# Altium project IMX547_Module.PrjPcb
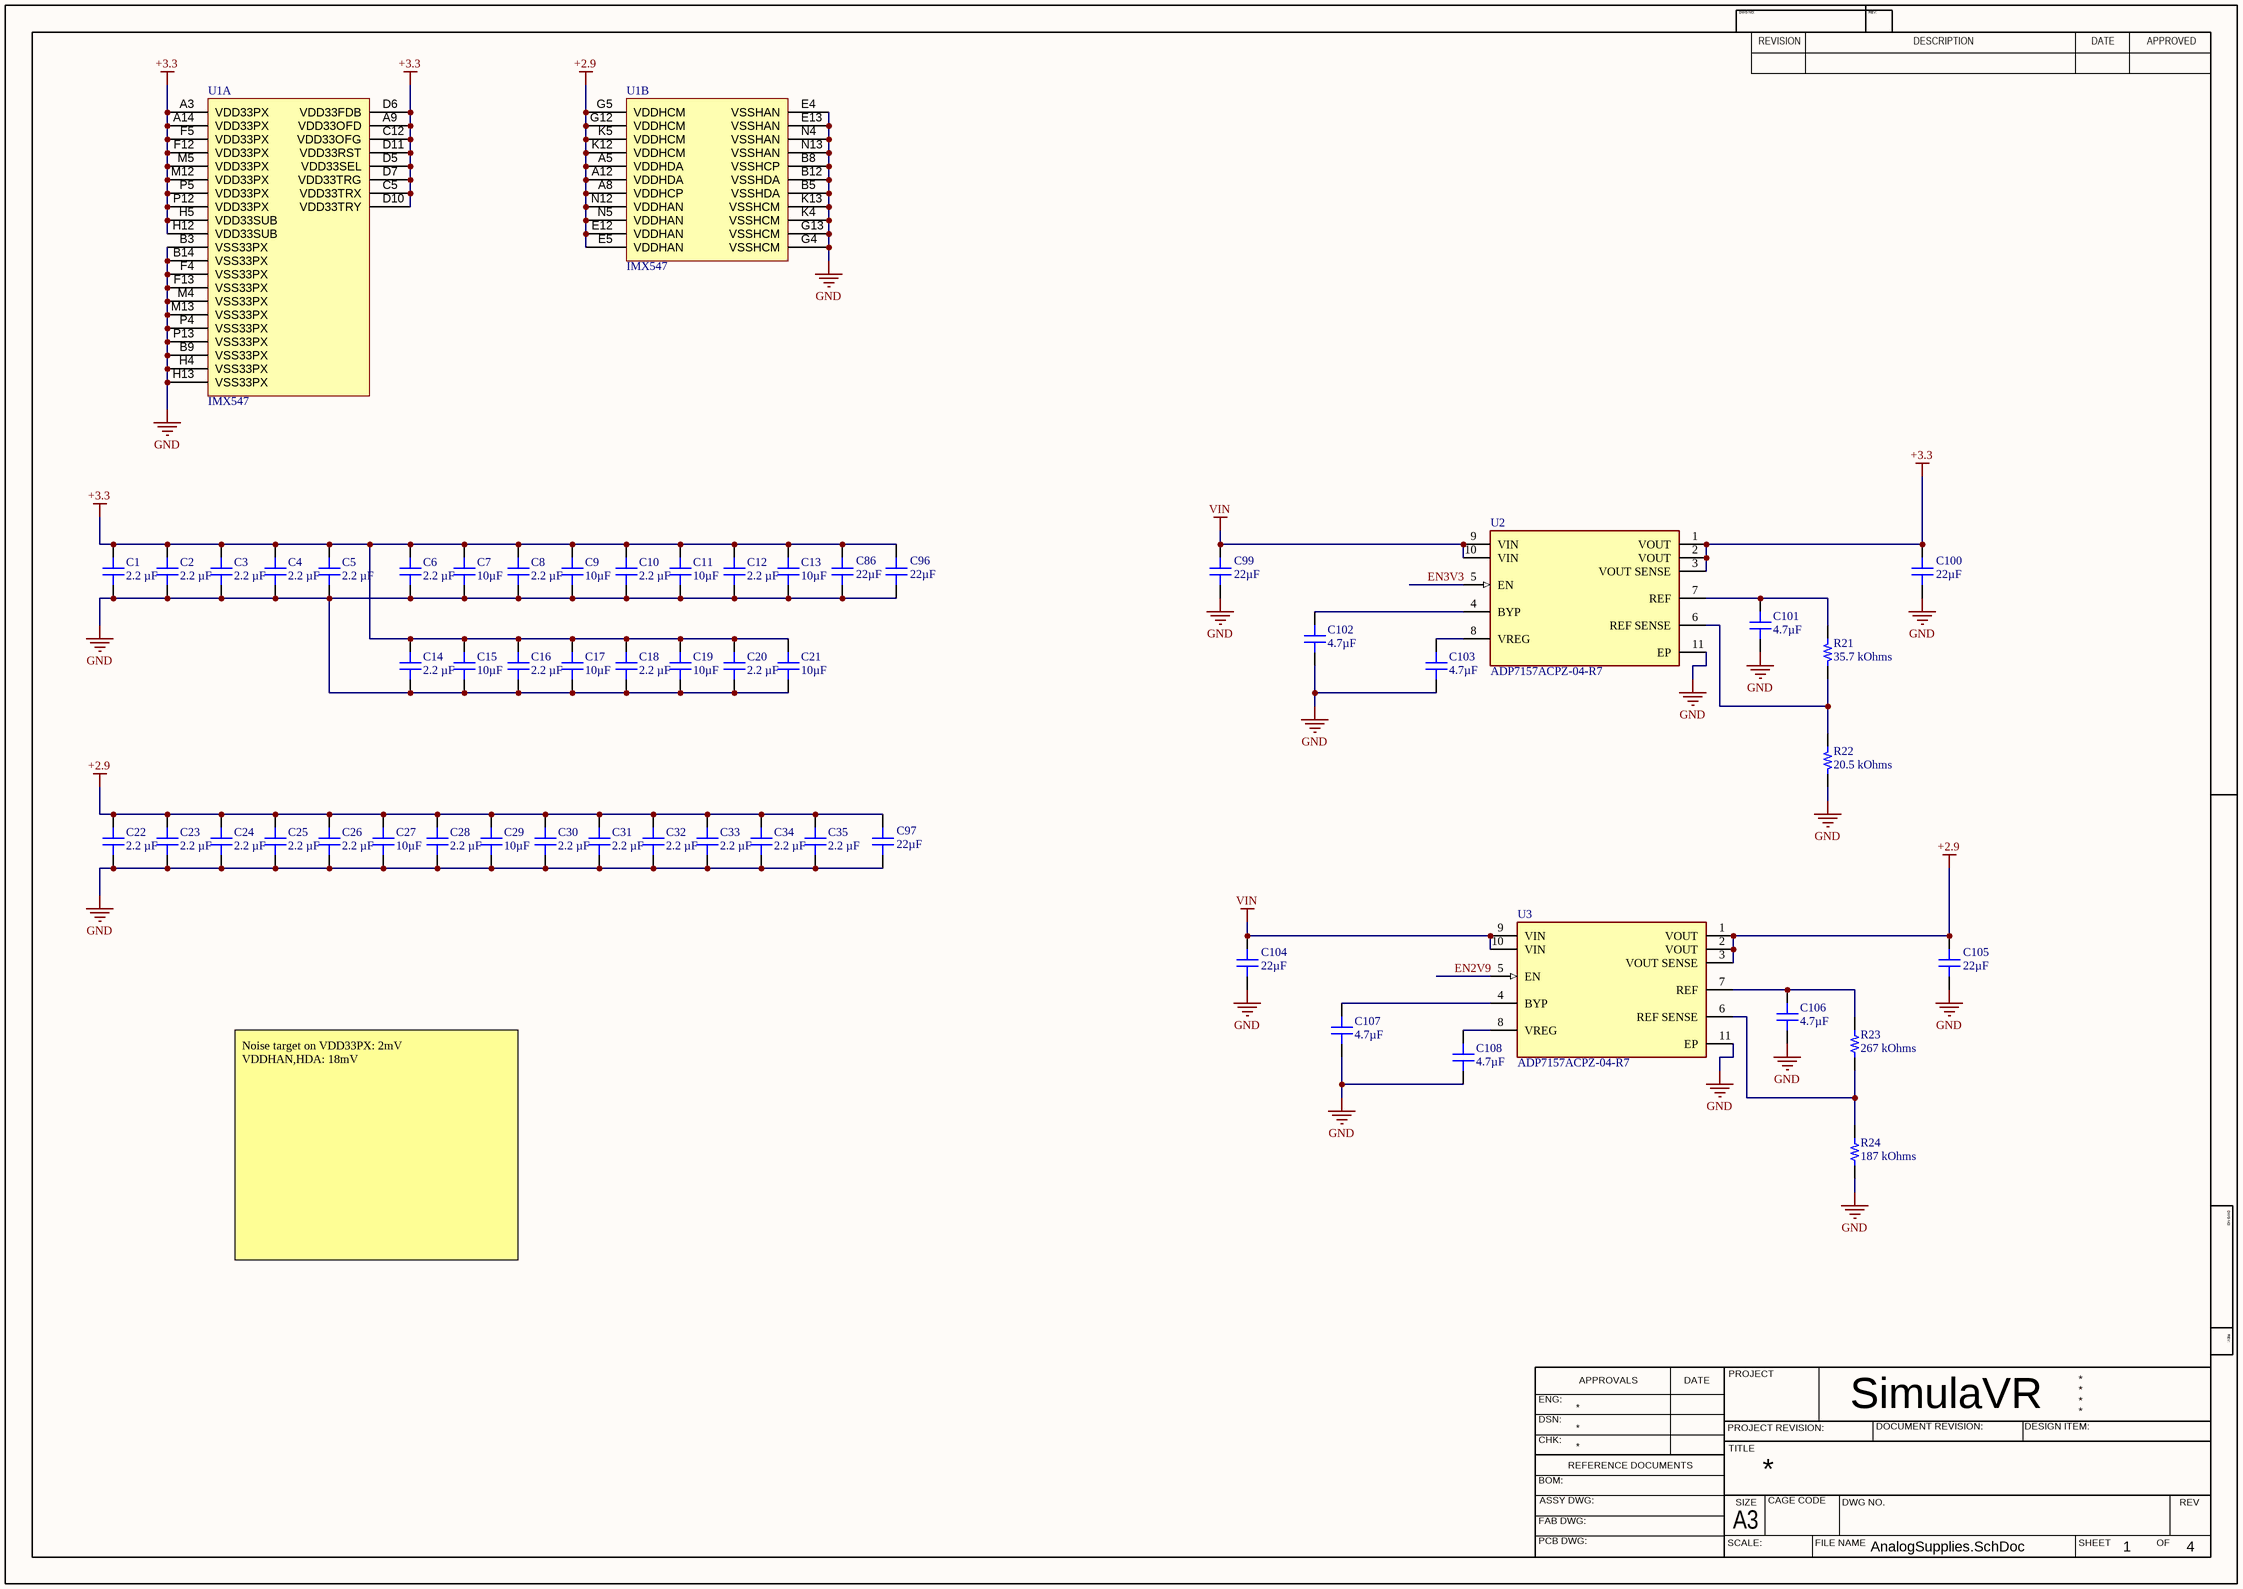
[diagram p0: AnalogSupplies.SchDoc]
4 sheets, 137 parts. Net scope: flat (ports and power ports of the same name join across sheets).
Board file: PCB.PcbDoc
Sheets:
  AnalogSupplies.SchDoc
  DigitalSupplies.SchDoc
  Misc.SchDoc
  DigitalIO.SchDoc

## Sheet AnalogSupplies.SchDoc
size 420 x 297 mm; SheetNumber: 1; SheetTotal: 4

### Parts
C1  2.2 µF  [FP-GRM033-0_09-MFG]
C2  2.2 µF  [FP-GRM033-0_09-MFG]
C3  2.2 µF  [FP-GRM033-0_09-MFG]
C4  2.2 µF  [FP-GRM033-0_09-MFG]
C5  2.2 µF  [FP-GRM033-0_09-MFG]
C6  2.2 µF  [FP-GRM033-0_09-MFG]
C7  10µF  [FP-GRM188-0_15-MFG]
C8  2.2 µF  [FP-GRM033-0_09-MFG]
C9  10µF  [FP-GRM188-0_15-MFG]
C10  2.2 µF  [FP-GRM033-0_09-MFG]
C11  10µF  [FP-GRM188-0_15-MFG]
C12  2.2 µF  [FP-GRM033-0_09-MFG]
C13  10µF  [FP-GRM188-0_15-MFG]
C14  2.2 µF  [FP-GRM033-0_09-MFG]
C15  10µF  [FP-GRM188-0_15-MFG]
C16  2.2 µF  [FP-GRM033-0_09-MFG]
C17  10µF  [FP-GRM188-0_15-MFG]
C18  2.2 µF  [FP-GRM033-0_09-MFG]
C19  10µF  [FP-GRM188-0_15-MFG]
C20  2.2 µF  [FP-GRM033-0_09-MFG]
C21  10µF  [FP-GRM188-0_15-MFG]
C22  2.2 µF  [FP-GRM033-0_09-MFG]
C23  2.2 µF  [FP-GRM033-0_09-MFG]
C24  2.2 µF  [FP-GRM033-0_09-MFG]
C25  2.2 µF  [FP-GRM033-0_09-MFG]
C26  2.2 µF  [FP-GRM033-0_09-MFG]
C27  10µF  [FP-GRM188-0_15-MFG]
C28  2.2 µF  [FP-GRM033-0_09-MFG]
C29  10µF  [FP-GRM188-0_15-MFG]
C30  2.2 µF  [FP-GRM033-0_09-MFG]
C31  2.2 µF  [FP-GRM033-0_09-MFG]
C32  2.2 µF  [FP-GRM033-0_09-MFG]
C33  2.2 µF  [FP-GRM033-0_09-MFG]
C34  2.2 µF  [FP-GRM033-0_09-MFG]
C35  2.2 µF  [FP-GRM033-0_09-MFG]
C86  22µF  [FP-GRM21B-0_2-e0_2_0_7-MFG]
C96  22µF  [FP-GRM21B-0_2-e0_2_0_7-MFG]
C97  22µF  [FP-GRM21B-0_2-e0_2_0_7-MFG]
C99  22µF  [FP-GRM21B-0_2-e0_2_0_7-MFG]
C100  22µF  [FP-GRM21B-0_2-e0_2_0_7-MFG]
C101  4.7µF  [FP-GRM155-0_15-MFG]
C102  4.7µF  [FP-GRM155-0_15-MFG]
C103  4.7µF  [FP-GRM155-0_15-MFG]
C104  22µF  [FP-GRM21B-0_2-e0_2_0_7-MFG]
C105  22µF  [FP-GRM21B-0_2-e0_2_0_7-MFG]
C106  4.7µF  [FP-GRM155-0_15-MFG]
C107  4.7µF  [FP-GRM155-0_15-MFG]
C108  4.7µF  [FP-GRM155-0_15-MFG]
R21  35.7 kOhms  [RES 0201_0603]
R22  20.5 kOhms  [RES 0201_0603]
R23  267 kOhms  [RES 0201_0603]
R24  187 kOhms  [RES 0201_0603]
U1  IMX547  [LGA230C100P16X17_1680X2000X260]  (parts A,B of 11)
U2  ADP7157ACPZ-04-R7  [FP-CP-10-9-IPC_B]
U3  ADP7157ACPZ-04-R7  [FP-CP-10-9-IPC_B]

### Nets
+2.9: C22.2 C23.2 C24.2 C25.2 C26.2 C27.2 C28.2 C29.2 C30.2 C31.2 C32.2 C33.2 C34.2 C35.2 C97.1 C105.1 U1.A5(VDDHDA) U1.A8(VDDHCP) U1.A12(VDDHDA) U1.E5(VDDHAN) U1.E12(VDDHAN) U1.G5(VDDHCM) U1.G12(VDDHCM) U1.K5(VDDHCM) U1.K12(VDDHCM) U1.N5(VDDHAN) U1.N12(VDDHAN) U3.1(VOUT) U3.2(VOUT) U3.3(VOUT_SENSE)
+3.3: C1.2 C2.2 C3.2 C4.2 C5.2 C6.2 C7.2 C8.2 C9.2 C10.2 C11.2 C12.2 C13.2 C14.2 C15.2 C16.2 C17.2 C18.2 C19.2 C20.2 C21.2 C86.1 C96.1 C100.1 U1.A3(VDD33PX) U1.A9(VDD33OFD) U1.A14(VDD33PX) U1.C5(VDD33TRX) U1.C12(VDD33OFG) U1.D5(VDD33SEL) U1.D6(VDD33FDB) U1.D7(VDD33TRG) U1.D10(VDD33TRY) U1.D11(VDD33RST) U1.F5(VDD33PX) U1.F12(VDD33PX) U1.H5(VDD33SUB) U1.H12(VDD33SUB) U1.M5(VDD33PX) U1.M12(VDD33PX) U1.P5(VDD33PX) U1.P12(VDD33PX) U2.1(VOUT) U2.2(VOUT) U2.3(VOUT_SENSE)
GND: C1.1 C2.1 C3.1 C4.1 C5.1 C6.1 C7.1 C8.1 C9.1 C10.1 C11.1 C12.1 C13.1 C14.1 C15.1 C16.1 C17.1 C18.1 C19.1 C20.1 C21.1 C22.1 C23.1 C24.1 C25.1 C26.1 C27.1 C28.1 C29.1 C30.1 C31.1 C32.1 C33.1 C34.1 C35.1 C86.2 C96.2 C97.2 C99.2 C100.2 C101.1 C102.1 C103.1 C104.2 C105.2 C106.1 C107.1 C108.1 R22.1 R24.1 U1.B3(VSS33PX) U1.B5(VSSHDA) U1.B8(VSSHCP) U1.B9(VSS33PX) U1.B12(VSSHDA) U1.B14(VSS33PX) U1.E4(VSSHAN) U1.E13(VSSHAN) U1.F4(VSS33PX) U1.F13(VSS33PX) U1.G4(VSSHCM) U1.G13(VSSHCM) U1.H4(VSS33PX) U1.H13(VSS33PX) U1.K4(VSSHCM) U1.K13(VSSHCM) U1.M4(VSS33PX) U1.M13(VSS33PX) U1.N4(VSSHAN) U1.N13(VSSHAN) U1.P4(VSS33PX) U1.P13(VSS33PX) U2.11(EP) U3.11(EP)
VIN: C99.1 C104.1 U2.9(VIN) U2.10(VIN) U3.9(VIN) U3.10(VIN)
EN2V9: U3.5(EN)
EN3V3: U2.5(EN)
NetC101_2: C101.2 R21.2 U2.7(REF)
NetC102_2: C102.2 U2.4(BYP)
NetC103_2: C103.2 U2.8(VREG)
NetC106_2: C106.2 R23.2 U3.7(REF)
NetC107_2: C107.2 U3.4(BYP)
NetC108_2: C108.2 U3.8(VREG)
NetR21_1: R21.1 R22.2 U2.6(REF_SENSE)
NetR23_1: R23.1 R24.2 U3.6(REF_SENSE)

### Notes on the sheet
- Noise target on VDD33PX: 2mV
  VDDHAN,HDA: 18mV
- DWG NO:
- REVISION
- REV:
- DESCRIPTION
- DATE
- APPROVED
- ENG:
- APPROVALS
- PROJECT
- DSN:
- CHK:
- REFERENCE DOCUMENTS
- PROJECT REVISION:
- TITLE
- SimulaVR
- DOCUMENT REVISION:
- DESIGN ITEM:
- BOM:
- FAB DWG:
- PCB DWG:
- ASSY DWG:
- SCALE:
- A3
- SIZE
- CAGE CODE
- FILE NAME
- DWG NO.
- SHEET
- OF
- REV

### Library data of the parts
C1-C6 C8 C10 C12 C14 C16 C18 C20 C22-C26 C28 C30-C35 = GRM033R60J225ME01D: CAP CER 2.2UF 6.3V X5R 0201; manufacturer: Murata Electronics; Tolerance: ±20%; Part Number: GRM033R60J225ME01D; Value: 2.2 µF; Applications: General Purpose; Capacitance: 2.2 µF; componentlink1description: Datasheet; componentlink1url: https://search.murata.co.jp/Ceramy/image/img/A01X/G101/ENG/GRM033R60J225ME01-01A.pdf; componentlink2description: DigiKey Link; componentlink2url: https://www.digikey.com/en/products/detail/murata-electronics/GRM033R60J225ME01D/16033628; Device Package: 0201 (0603 Metric); lastupdated: 19.09.2022 12:54:17; Lifecycle Status: Active; Minimum Order: 1; Mounting Type: Surface Mount, MLCC; Operating Temperature: -55°C ~ 85°C; Package / Case: 0201 (0603 Metric); packaging: TapeAndReel; partid: 41005; Part Status: Active; price: 0.02; series: GRM; Size / Dimension: 0.024" L x 0.012" W (0.60mm x 0.30mm); Supplier 1: DigiKey; Supplier Part Number 1: 490-GRM033R60J225ME01DCT-ND; Temperature Coefficient: X5R; Thickness (Max): 0.015" (0.39mm); Voltage - Rated: 6.3V
C7 C9 C11 C13 C15 C17 C19 C21 C27 C29 = GRM188R61A106MAALD: CAP CER 10UF 10V X5R 0603; Manufacturer: Murata Electronics; Tolerance: ±20%; Part Number: GRM188R61A106MAALD; Value: 10µF; Applications: General Purpose; Capacitance: 10µF; ComponentLink1Description: Datasheet; ComponentLink1URL: https://search.murata.co.jp/Ceramy/image/img/A01X/G101/ENG/GRM188R61A106MAAL-01.pdf; ComponentLink2Description: DigiKey Link; ComponentLink2URL: http://digikey.com/product-detail/en/murata-electronics/GRM188R61A106MAALD/490-12734-1-ND/5797703; Device Package: 0603 (1608 Metric); LastUpdated: 9/2/2020 1:03:35 AM; Lifecycle Status: Active; Minimum Order: 1; Mounting Type: Surface Mount, MLCC; Operating Temperature: -55°C ~ 85°C; Package / Case: 0603 (1608 Metric); Packaging: TapeAndReel; PartId: 2423; Part Status: Active; Price: 0.08; Series: GRM; Size / Dimension: 0.063" L x 0.031" W (1.60mm x 0.80mm); Supplier 1: DigiKey; Supplier Part Number 1: 490-12734-1-ND; Temperature Coefficient: X5R; Thickness (Max): 0.037" (0.95mm); Voltage - Rated: 10V
C86 C96 C97 C99 C100 C104 C105 = GRM21BR61A226ME44L: CAP CER 22UF 10V X5R 0805; Manufacturer: Murata Electronics; Tolerance: ±20%; Part Number: GRM21BR61A226ME44L; Value: 22µF; Capacitance: 22µF; ComponentLink1Description: Datasheet; ComponentLink1URL: https://search.murata.co.jp/Ceramy/image/img/A01X/G101/ENG/GRM21BR61A226ME44-01.pdf; ComponentLink2Description: DigiKey Link; ComponentLink2URL: http://digikey.com/product-detail/en/murata-electronics/GRM21BR61A226ME44L/490-10746-1-ND/5251354; Device Package: 0805 (2012 Metric); LastUpdated: 9/2/2020 1:04:36 AM; Lifecycle Status: Active; Minimum Order: 1; Mounting Type: Surface Mount, MLCC; Operating Temperature: -55°C ~ 85°C; Package / Case: 0805 (2012 Metric); Packaging: TapeAndReel; PartId: 6027; Part Status: Active; Price: 0.12; Series: GRM; Size / Dimension: 0.079" L x 0.049" W (2.00mm x 1.25mm); Supplier 1: DigiKey; Supplier Part Number 1: 490-10746-1-ND; Voltage - Rated: 10V; Applications: General Purpose; Temperature Coefficient: X5R; Thickness (Max): 0.057" (1.45mm)
C101-C103 C106-C108 = GRM155R61A475MEAAD: CAP CER 4.7UF 10V X5R 0402; Manufacturer: Murata Electronics; Tolerance: ±20%; Part Number: GRM155R61A475MEAAD; Value: 4.7µF; Applications: General Purpose; Capacitance: 4.7µF; ComponentLink1Description: Datasheet; ComponentLink1URL: https://search.murata.co.jp/Ceramy/image/img/A01X/G101/ENG/GRM155R61A475MEAA-01.pdf; ComponentLink2Description: DigiKey Link; ComponentLink2URL: https://www.digikey.com/en/products/detail/murata-electronics/GRM155R61A475MEAAD/6234735; Device Package: 0402 (1005 Metric); LastUpdated: 2/8/2022 12:26:50 PM; Lifecycle Status: Active; Minimum Order: 1; Mounting Type: Surface Mount, MLCC; Operating Temperature: -55°C ~ 85°C; Package / Case: 0402 (1005 Metric); Packaging: TapeAndReel; PartId: 6746; Part Status: Active; Price: 0.03; Series: GRM; Size / Dimension: 0.039" L x 0.020" W (1.00mm x 0.50mm); Supplier 1: DigiKey; Supplier Part Number 1: 490-14306-1-ND; Temperature Coefficient: X5R; Thickness (Max): 0.026" (0.65mm); Voltage - Rated: 10V
R21 = ERJ-1GNF3572C: RES SMD 35.7K OHM 1% 1/20W 0201; Manufacturer: Panasonic Electronic Components; Power (Watts): 0.05W, 1/20W; Temperature Coefficient: ±200ppm/°C; Part Number: ERJ-1GNF3572C; Value: 35.7 kOhms; ComponentLink1Description: Datasheet; ComponentLink1URL: https://industrial.panasonic.com/cdbs/www-data/pdf/RDA0000/AOA0000C304.pdf; ComponentLink2Description: DigiKey Link; ComponentLink2URL: https://www.digikey.com/en/products/detail/panasonic-electronic-components/ERJ-1GNF3572C/2036287; Composition: Thick Film; Device Package: 0201 (0603 Metric); Features: Automotive AEC-Q200; Height - Seated (Max): 0.010" (0.26mm); LastUpdated: 5/20/2022 2:48:18 PM; Lifecycle Status: Active; Minimum Order: 1; Number of Terminations: 2; Operating Temperature: -55°C ~ 125°C; Package / Case: 0201 (0603 Metric); Packaging: TapeAndReel; PartId: 448; Part Status: Active; Price: 0.01; Ratings: AEC-Q200; Resistance: 35.7 kOhms; Series: ERJ-1GN; Size / Dimension: 0.024" L x 0.012" W (0.60mm x 0.30mm); Supplier 1: DigiKey; Supplier Part Number 1: P122958CT-ND; Supplier Device Package: 0201; Tolerance: ±1%
R22 = ERJ-1GNF2052C: RES SMD 20.5K OHM 1% 1/20W 0201; Manufacturer: Panasonic Electronic Components; Power (Watts): 0.05W, 1/20W; Temperature Coefficient: ±200ppm/°C; Part Number: ERJ-1GNF2052C; Value: 20.5 kOhms; ComponentLink1Description: Datasheet; ComponentLink1URL: https://industrial.panasonic.com/cdbs/www-data/pdf/RDA0000/AOA0000C304.pdf; ComponentLink2Description: DigiKey Link; ComponentLink2URL: http://digikey.com/product-detail/en/panasonic-electronic-components/ERJ-1GNF2052C/P122817CT-ND/8342573; Composition: Thick Film; Device Package: 0201 (0603 Metric); Features: Automotive AEC-Q200; Height - Seated (Max): 0.010" (0.26mm); LastUpdated: 5/20/2022 2:47:55 PM; Lifecycle Status: Active; Minimum Order: 1; Number of Terminations: 2; Operating Temperature: -55°C ~ 125°C; Package / Case: 0201 (0603 Metric); Packaging: TapeAndReel; PartId: 4106; Part Status: Active; Price: 0.01; Ratings: AEC-Q200; Resistance: 20.5 kOhms; Series: ERJ; Size / Dimension: 0.024" L x 0.012" W (0.60mm x 0.30mm); Supplier 1: DigiKey; Supplier Part Number 1: P122817CT-ND; Supplier Device Package: 0201; Tolerance: ±1%
R23 = RC0201FR-07267KL: RES 267K OHM 1% 1/20W 0201; Manufacturer: Yageo; Power (Watts): 0.05W, 1/20W; Temperature Coefficient: ±200ppm/°C; Part Number: RC0201FR-07267KL; Value: 267 kOhms; ComponentLink1Description: Datasheet; ComponentLink1URL: https://www.yageo.com/upload/media/product/productsearch/datasheet/rchip/PYu-RC_Group_51_RoHS_L_10.pdf; ComponentLink2Description: DigiKey Link; ComponentLink2URL: https://www.digikey.com/en/products/detail/yageo/RC0201FR-07267KL/5280402; Composition: Thick Film; Device Package: 0201 (0603 Metric); Features: Moisture Resistant; Height - Seated (Max): 0.010" (0.26mm); LastUpdated: 5/20/2022 2:48:07 PM; Lifecycle Status: Active; Minimum Order: 1; Number of Terminations: 2; Operating Temperature: -55°C ~ 125°C; Package / Case: 0201 (0603 Metric); Packaging: CutTape; PartId: 1831; Part Status: Active; Price: 0.01; Resistance: 267 kOhms; Series: RC_L; Size / Dimension: 0.024" L x 0.012" W (0.60mm x 0.30mm); Supplier 1: DigiKey; Supplier Part Number 1: YAG2542CT-ND; Supplier Device Package: 0201; Tolerance: ±1%
R24 = ERJ-1GNF1873C: RES SMD 187K OHM 1% 1/20W 0201; Manufacturer: Panasonic Electronic Components; Power (Watts): 0.05W, 1/20W; Temperature Coefficient: ±200ppm/°C; Part Number: ERJ-1GNF1873C; Value: 187 kOhms; ComponentLink1Description: Datasheet; ComponentLink1URL: https://industrial.panasonic.com/cdbs/www-data/pdf/RDA0000/AOA0000C304.pdf; ComponentLink2Description: DigiKey Link; ComponentLink2URL: https://www.digikey.com/en/products/detail/panasonic-electronic-components/ERJ-1GNF1873C/2036369; Composition: Thick Film; Device Package: 0201 (0603 Metric); Features: Automotive AEC-Q200; Height - Seated (Max): 0.010" (0.26mm); LastUpdated: 5/20/2022 2:48:21 PM; Lifecycle Status: Active; Minimum Order: 1; Number of Terminations: 2; Operating Temperature: -55°C ~ 125°C; Package / Case: 0201 (0603 Metric); Packaging: TapeAndReel; PartId: 70; Part Status: Active; Price: 0.01; Ratings: AEC-Q200; Resistance: 187 kOhms; Series: ERJ-1GN; Size / Dimension: 0.024" L x 0.012" W (0.60mm x 0.30mm); Supplier 1: DigiKey; Supplier Part Number 1: P122798CT-ND; Supplier Device Package: 0201; Tolerance: ±1%
U1 = CMP-001-0000-4: Sony IMX547 sensor
U2 U3 = CMP-019-00054-1: LDO Regulator Pos 1.2V to 3.3V 1.2A 10-Pin LFCSP EP T/R

## Sheet DigitalSupplies.SchDoc
size 420 x 297 mm; SheetNumber: 2; SheetTotal: 4
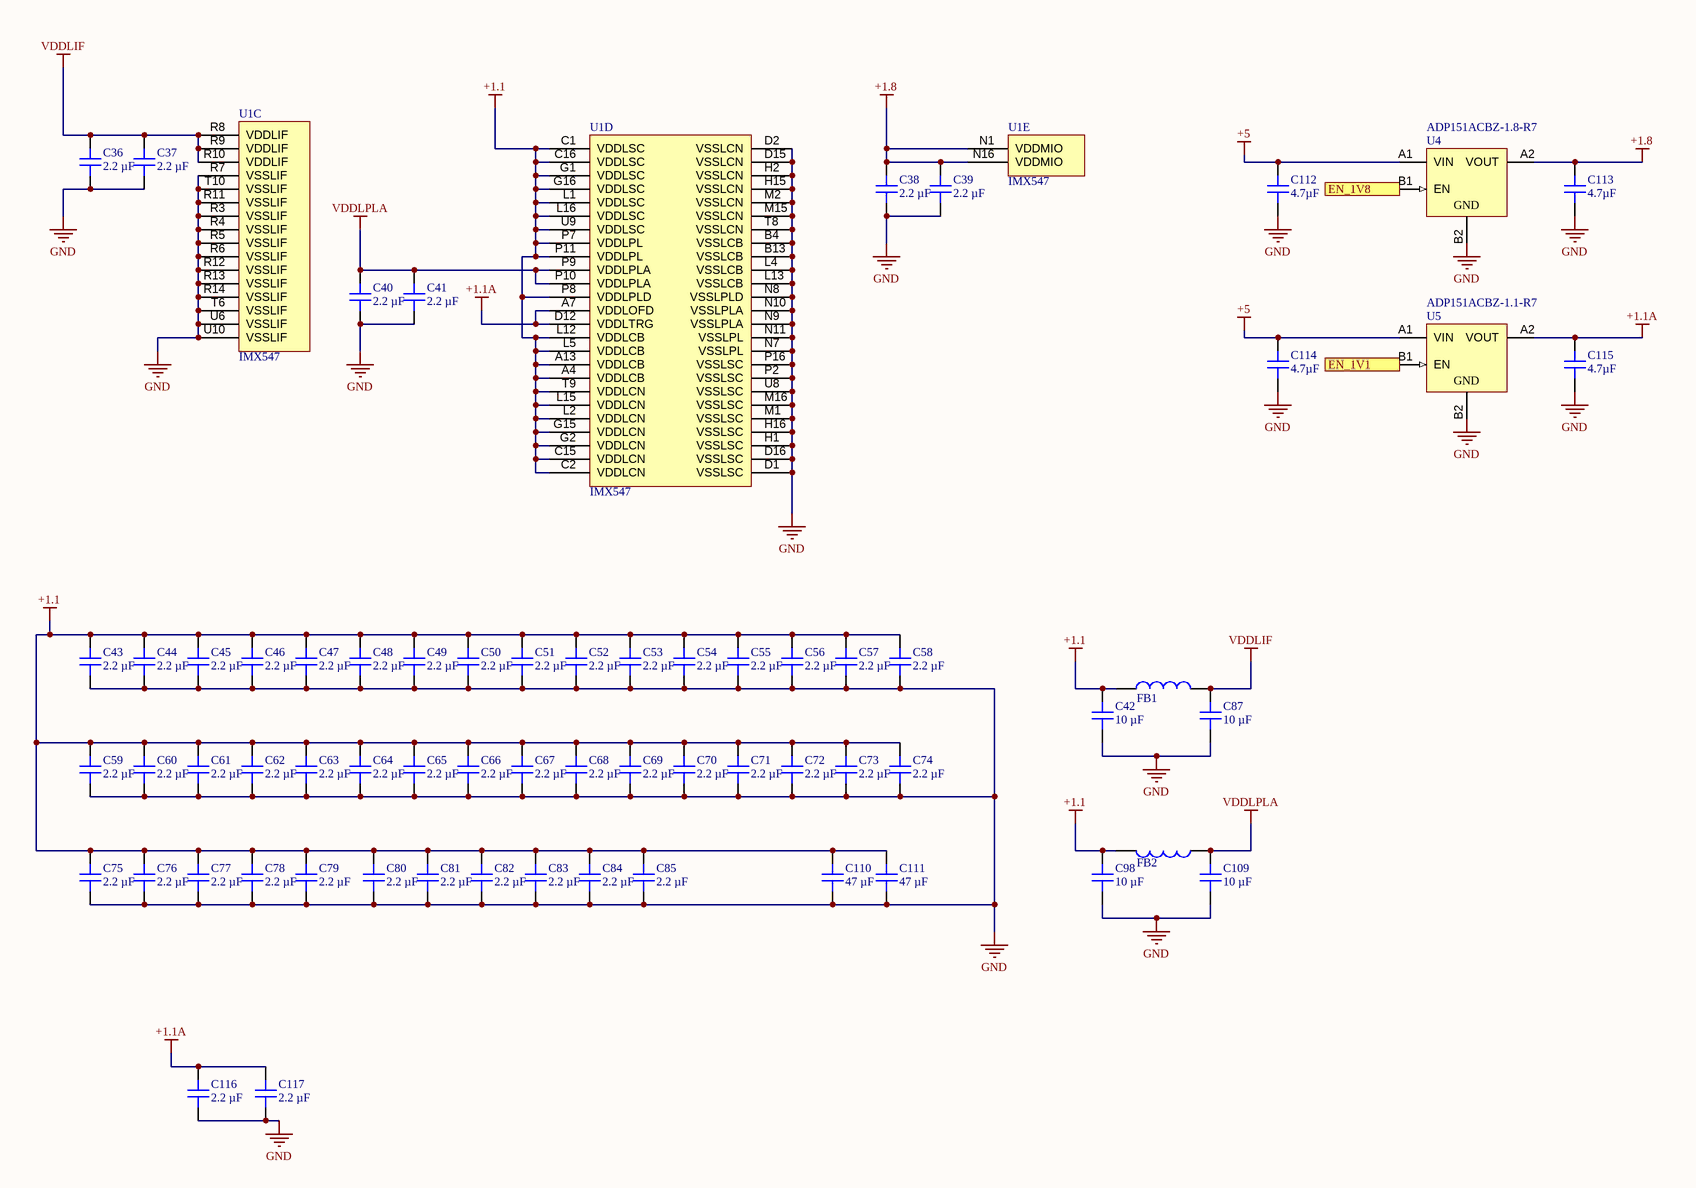
[diagram p1: DigitalSupplies.SchDoc]

### Parts
C36  2.2 µF  [FP-GRM033-0_09-MFG]
C37  2.2 µF  [FP-GRM033-0_09-MFG]
C38  2.2 µF  [FP-GRM033-0_09-MFG]
C39  2.2 µF  [FP-GRM033-0_09-MFG]
C40  2.2 µF  [FP-GRM033-0_09-MFG]
C41  2.2 µF  [FP-GRM033-0_09-MFG]
C42  10 µF  [FP-GRM155-0_15-MFG]
C43  2.2 µF  [FP-GRM033-0_09-MFG]
C44  2.2 µF  [FP-GRM033-0_09-MFG]
C45  2.2 µF  [FP-GRM033-0_09-MFG]
C46  2.2 µF  [FP-GRM033-0_09-MFG]
C47  2.2 µF  [FP-GRM033-0_09-MFG]
C48  2.2 µF  [FP-GRM033-0_09-MFG]
C49  2.2 µF  [FP-GRM033-0_09-MFG]
C50  2.2 µF  [FP-GRM033-0_09-MFG]
C51  2.2 µF  [FP-GRM033-0_09-MFG]
C52  2.2 µF  [FP-GRM033-0_09-MFG]
C53  2.2 µF  [FP-GRM033-0_09-MFG]
C54  2.2 µF  [FP-GRM033-0_09-MFG]
C55  2.2 µF  [FP-GRM033-0_09-MFG]
C56  2.2 µF  [FP-GRM033-0_09-MFG]
C57  2.2 µF  [FP-GRM033-0_09-MFG]
C58  2.2 µF  [FP-GRM033-0_09-MFG]
C59  2.2 µF  [FP-GRM033-0_09-MFG]
C60  2.2 µF  [FP-GRM033-0_09-MFG]
C61  2.2 µF  [FP-GRM033-0_09-MFG]
C62  2.2 µF  [FP-GRM033-0_09-MFG]
C63  2.2 µF  [FP-GRM033-0_09-MFG]
C64  2.2 µF  [FP-GRM033-0_09-MFG]
C65  2.2 µF  [FP-GRM033-0_09-MFG]
C66  2.2 µF  [FP-GRM033-0_09-MFG]
C67  2.2 µF  [FP-GRM033-0_09-MFG]
C68  2.2 µF  [FP-GRM033-0_09-MFG]
C69  2.2 µF  [FP-GRM033-0_09-MFG]
C70  2.2 µF  [FP-GRM033-0_09-MFG]
C71  2.2 µF  [FP-GRM033-0_09-MFG]
C72  2.2 µF  [FP-GRM033-0_09-MFG]
C73  2.2 µF  [FP-GRM033-0_09-MFG]
C74  2.2 µF  [FP-GRM033-0_09-MFG]
C75  2.2 µF  [FP-GRM033-0_09-MFG]
C76  2.2 µF  [FP-GRM033-0_09-MFG]
C77  2.2 µF  [FP-GRM033-0_09-MFG]
C78  2.2 µF  [FP-GRM033-0_09-MFG]
C79  2.2 µF  [FP-GRM033-0_09-MFG]
C80  2.2 µF  [FP-GRM033-0_09-MFG]
C81  2.2 µF  [FP-GRM033-0_09-MFG]
C82  2.2 µF  [FP-GRM033-0_09-MFG]
C83  2.2 µF  [FP-GRM033-0_09-MFG]
C84  2.2 µF  [FP-GRM033-0_09-MFG]
C85  2.2 µF  [FP-GRM033-0_09-MFG]
C87  10 µF  [FP-GRM155-0_15-MFG]
C98  10 µF  [FP-GRM155-0_15-MFG]
C109  10 µF  [FP-GRM155-0_15-MFG]
C110  47 µF  [FP-GRM188-0_15-MFG]
C111  47 µF  [FP-GRM188-0_15-MFG]
C112  4.7µF  [FP-GRM155-0_15-MFG]
C113  4.7µF  [FP-GRM155-0_15-MFG]
C114  4.7µF  [FP-GRM155-0_15-MFG]
C115  4.7µF  [FP-GRM155-0_15-MFG]
C116  2.2 µF  [FP-GRM033-0_09-MFG]
C117  2.2 µF  [FP-GRM033-0_09-MFG]
FB1  742843122  [WE-CBF HF_0402_High Current]  (value not drawn)
FB2  742843122  [WE-CBF HF_0402_High Current]  (value not drawn)
U1  IMX547  [LGA230C100P16X17_1680X2000X260]  (parts C,D,E of 11)
U4  ADP151ACBZ-1.8-R7  [ADI-CB-4-3]
U5  ADP151ACBZ-1.1-R7  [ADI-CB-4-3]

### Ports
EN_1V1, EN_1V8 (in)

### Nets
+1.1: C42.2 C43.2 C44.2 C45.2 C46.2 C47.2 C48.2 C49.2 C50.2 C51.2 C52.2 C53.2 C54.2 C55.2 C56.2 C57.2 C58.2 C59.2 C60.2 C61.2 C62.2 C63.2 C64.2 C65.2 C66.2 C67.2 C68.2 C69.2 C70.2 C71.2 C72.2 C73.2 C74.2 C75.2 C76.2 C77.2 C78.2 C79.2 C80.2 C81.2 C82.2 C83.2 C84.2 C85.2 C98.2 C110.2 C111.2 FB1.1 FB2.2 U1.A4(VDDLCB) U1.A13(VDDLCB) U1.C1(VDDLSC) U1.C2(VDDLCN) U1.C15(VDDLCN) U1.C16(VDDLSC) U1.G1(VDDLSC) U1.G2(VDDLCN) U1.G15(VDDLCN) U1.G16(VDDLSC) U1.L1(VDDLSC) U1.L2(VDDLCN) U1.L5(VDDLCB) U1.L12(VDDLCB) U1.L15(VDDLCN) U1.L16(VDDLSC) U1.P7(VDDLPL) U1.P8(VDDLPLD) U1.P11(VDDLPL) U1.T9(VDDLCN) U1.U9(VDDLSC)
+1.1A: C115.2 C116.2 C117.2 U1.A7(VDDLOFD) U1.D12(VDDLTRG) U5.A2(VOUT)
+1.8: C38.2 C39.2 C113.2 U1.N1(VDDMIO) U1.N16(VDDMIO) U4.A2(VOUT)
+5: C112.2 C114.2 U4.A1(VIN) U5.A1(VIN)
GND: C36.1 C37.1 C38.1 C39.1 C40.1 C41.1 C42.1 C43.1 C44.1 C45.1 C46.1 C47.1 C48.1 C49.1 C50.1 C51.1 C52.1 C53.1 C54.1 C55.1 C56.1 C57.1 C58.1 C59.1 C60.1 C61.1 C62.1 C63.1 C64.1 C65.1 C66.1 C67.1 C68.1 C69.1 C70.1 C71.1 C72.1 C73.1 C74.1 C75.1 C76.1 C77.1 C78.1 C79.1 C80.1 C81.1 C82.1 C83.1 C84.1 C85.1 C87.1 C98.1 C109.1 C110.1 C111.1 C112.1 C113.1 C114.1 C115.1 C116.1 C117.1 U1.B4(VSSLCB) U1.B13(VSSLCB) U1.D1(VSSLSC) U1.D2(VSSLCN) U1.D15(VSSLCN) U1.D16(VSSLSC) U1.H1(VSSLSC) U1.H2(VSSLCN) U1.H15(VSSLCN) U1.H16(VSSLSC) U1.L4(VSSLCB) U1.L13(VSSLCB) U1.M1(VSSLSC) U1.M2(VSSLCN) U1.M15(VSSLCN) U1.M16(VSSLSC) U1.N7(VSSLPL) U1.N8(VSSLPLD) U1.N9(VSSLPLA) U1.N10(VSSLPLA) U1.N11(VSSLPL) U1.P2(VSSLSC) U1.P16(VSSLSC) U1.R3(VSSLIF) U1.R4(VSSLIF) U1.R5(VSSLIF) U1.R6(VSSLIF) U1.R7(VSSLIF) U1.R11(VSSLIF) U1.R12(VSSLIF) U1.R13(VSSLIF) U1.R14(VSSLIF) U1.T6(VSSLIF) U1.T8(VSSLCN) U1.T10(VSSLIF) U1.U6(VSSLIF) U1.U8(VSSLSC) U1.U10(VSSLIF) U4.B2(GND) U5.B2(GND)
VDDLIF: C36.2 C37.2 C87.2 FB1.2 U1.R8(VDDLIF) U1.R9(VDDLIF) U1.R10(VDDLIF)
VDDLPLA: C40.2 C41.2 C109.2 FB2.1 U1.P9(VDDLPLA) U1.P10(VDDLPLA)
NetU4_B1: U4.B1(EN) ; port EN_1V8
NetU5_B1: U5.B1(EN) ; port EN_1V1

### Notes on the sheet
- DWG NO:
- REVISION
- REV:
- DESCRIPTION
- DATE
- APPROVED
- ENG:
- APPROVALS
- PROJECT
- DSN:
- CHK:
- REFERENCE DOCUMENTS
- PROJECT REVISION:
- TITLE
- SimulaVR
- DOCUMENT REVISION:
- DESIGN ITEM:
- BOM:
- FAB DWG:
- PCB DWG:
- ASSY DWG:
- SCALE:
- A3
- SIZE
- CAGE CODE
- FILE NAME
- DWG NO.
- SHEET
- OF
- REV

### Library data of the parts
C36-C41 C43-C85 C116 C117 = GRM033R60J225ME01D: as C1 on sheet AnalogSupplies; Part Number: GRM033R60J225ME01D; Value: 2.2 µF; Applications: General Purpose; Capacitance: 2.2 µF; componentlink1description: Datasheet; componentlink1url: https://search.murata.co.jp/Ceramy/image/img/A01X/G101/ENG/GRM033R60J225ME01-01A.pdf; componentlink2description: DigiKey Link; componentlink2url: https://www.digikey.com/en/products/detail/murata-electronics/GRM033R60J225ME01D/16033628; Device Package: 0201 (0603 Metric); lastupdated: 19.09.2022 12:54:17; Lifecycle Status: Active; Minimum Order: 1; Mounting Type: Surface Mount, MLCC; Operating Temperature: -55°C ~ 85°C; Package / Case: 0201 (0603 Metric); packaging: TapeAndReel; partid: 41005; Part Status: Active; price: 0.02; series: GRM; Size / Dimension: 0.024" L x 0.012" W (0.60mm x 0.30mm); Supplier 1: DigiKey; Supplier Part Number 1: 490-GRM033R60J225ME01DCT-ND; Temperature Coefficient: X5R; Thickness (Max): 0.015" (0.39mm); Voltage - Rated: 6.3V
C42 C87 C98 C109 = GRM155R60J106ME15D: CAP CER 10UF 6.3V X5R 0402; manufacturer: Murata Electronics; Tolerance: ±20%; Part Number: GRM155R60J106ME15D; Value: 10 µF; Applications: General Purpose; Capacitance: 10 µF; componentlink1description: Datasheet; componentlink1url: https://www.murata.com/~/media/webrenewal/support/library/catalog/products/capacitor/mlcc/c02e.ashx?la=en-us; componentlink2description: DigiKey Link; componentlink2url: https://www.digikey.com/en/products/detail/murata-electronics/GRM155R60J106ME15D/5877401; Device Package: 0402 (1005 Metric); lastupdated: 19.09.2022 12:57:20; Lifecycle Status: Active; Minimum Order: 1; Mounting Type: Surface Mount, MLCC; Operating Temperature: -55°C ~ 85°C; Package / Case: 0402 (1005 Metric); packaging: TapeAndReel; partid: 6754; Part Status: Active; price: 0.02; series: GRM; Size / Dimension: 0.039" L x 0.020" W (1.00mm x 0.50mm); Supplier 1: DigiKey; Supplier Part Number 1: 490-13238-1-ND; Temperature Coefficient: X5R; Thickness (Max): 0.026" (0.65mm); Voltage - Rated: 6.3V
C110 C111 = GRM188R60J476ME01D: CAP CER 47UF 6.3V X5R 0603; manufacturer: Murata Electronics; Tolerance: ±20%; Part Number: GRM188R60J476ME01D; Value: 47 µF; Applications: General Purpose; Capacitance: 47 µF; componentlink2description: DigiKey Link; componentlink2url: https://www.digikey.com/en/products/detail/murata-electronics/GRM188R60J476ME01D/13996874; Device Package: 0603 (1608 Metric); lastupdated: 5/20/2022 2:38:45 PM; Lifecycle Status: Active; Minimum Order: 1; Mounting Type: Surface Mount, MLCC; Operating Temperature: -55°C ~ 85°C; Package / Case: 0603 (1608 Metric); packaging: TapeAndReel; partid: 44498; Part Status: Active; price: 0.10; series: GRM; Size / Dimension: 0.063" L x 0.031" W (1.60mm x 0.80mm); Supplier 1: DigiKey; Supplier Part Number 1: 490-GRM188R60J476ME01DCT-ND; Temperature Coefficient: X5R; Thickness (Max): 0.039" (1.00mm); Voltage - Rated: 6.3V
C112-C115 = GRM155R61A475MEAAD: as C101 on sheet AnalogSupplies; Part Number: GRM155R61A475MEAAD; Value: 4.7µF; Applications: General Purpose; Capacitance: 4.7µF; ComponentLink1Description: Datasheet; ComponentLink1URL: https://search.murata.co.jp/Ceramy/image/img/A01X/G101/ENG/GRM155R61A475MEAA-01.pdf; ComponentLink2Description: DigiKey Link; ComponentLink2URL: https://www.digikey.com/en/products/detail/murata-electronics/GRM155R61A475MEAAD/6234735; Device Package: 0402 (1005 Metric); LastUpdated: 2/8/2022 12:26:50 PM; Lifecycle Status: Active; Minimum Order: 1; Mounting Type: Surface Mount, MLCC; Operating Temperature: -55°C ~ 85°C; Package / Case: 0402 (1005 Metric); Packaging: TapeAndReel; PartId: 6746; Part Status: Active; Price: 0.03; Series: GRM; Size / Dimension: 0.039" L x 0.020" W (1.00mm x 0.50mm); Supplier 1: DigiKey; Supplier Part Number 1: 490-14306-1-ND; Temperature Coefficient: X5R; Thickness (Max): 0.026" (0.65mm); Voltage - Rated: 10V
FB1 FB2 = CMP-015-000002-1: WE-CBF HF SMT High Frequency EMI Suppression Ferrite Bead, size 0402, 220O, 0.8A; Manufacturer: Wurth Elektronik; Impedance @1GHz: 300O; Impedance Max Test Condition: 750MHz; Case/Size Code: 0402; Type: High Current; Impedance Max: 400O; DC Resistance: 0.25O; ComponentLink2Description: Datasheet Link; Impedance @100MHz: 220O; Category: Ferrites for PCB Assembly; ComponentLink1Description: Website Link; ComponentLink2URL: https://www.we-online.com/redexpert/spec/742843122?ad; Packaging: Tape and Reel; Design Item ID: 742843122; Rated Current: 0.8A; Manufacturer Part Number: 742843122; Match Code: WE-CBF HF; Length: 1mm; Pin Count: 2; Height: 0.5mm; Width: 0.5mm; Operating Temperature Min: -55°C; Mount: Surface Mount; Source: WE-CBF HF.SchLib; Component Type: Standard; ComponentLink1URL: https://www.we-online.com/redexpert/article/742843122?ad; Operating Temperature Max: 125°C
U1 = CMP-001-0000-4: Sony IMX547 sensor
U4 = CMP-0786-00016-1: Ultralow Noise, 200 mA, CMOS Linear Regulator, 2.2 to 5.5 V Vin, 1.8 V Vout, Industrial, 4-pin BGA (CB-4-3), Reel; Manufacturer: Analog Devices; Iout max: 200mA; Vin (max) (V): 5.5; Preset Vout Values (V): 1.8; Vin (min) (V): 2.2; Supply Current IGND @ Small Load: 10uA; ComponentLink3Description: Package Specification; Packing: Reel; Mounting Technology: Surface Mount; ComponentLink1Description: Manufacturer URL; PackageReference: CB-4-3; ComponentLink3URL: http:/www.analog.com/static/imported-files/packages/PKG_PDF/WLCSP(CB)/CB_4_3.pdf; ComponentLink4Description: URL Link1; ComponentLink2URL: http://www.analog.com/static/imported-files/data_sheets/ADP151.pdf; PackageVersion: 011409-A, 01/2009; ComponentLink2Description: Datasheet; PartNumber: ADP151ACBZ-1.8-R7; ComponentLink1URL: http://www.analog.com/en/index.html; PackageDescription: 4-Ball Wafer Level Chip Scale Package, Body 0.76 x 0.76 mm, Pitch 0.4 mm; ComponentLink4URL: Product URL:http://www.analog.com/en/ADP151/productSearch.html; DatasheetVersion: Rev. E
U5 = CMP-0786-00003-1: Ultralow Noise, 200 mA, CMOS Linear Regulator, 2.2 to 5.5 V Vin, 1.1 V Vout, Industrial, 4-pin BGA (CB-4-3), Reel; Manufacturer: Analog Devices; Vin (max) (V): 5.5; Iout max: 200mA; Vin (min) (V): 2.2; Supply Current IGND @ Small Load: 10uA; Preset Vout Values (V): 1.1; ComponentLink1Description: Manufacturer URL; ComponentLink4URL: Product URL:http://www.analog.com/en/ADP151/productSearch.html; ComponentLink3URL: http:/www.analog.com/static/imported-files/packages/PKG_PDF/WLCSP(CB)/CB_4_3.pdf; PackageDescription: 4-Ball Wafer Level Chip Scale Package, Body 0.76 x 0.76 mm, Pitch 0.4 mm; PackageReference: CB-4-3; ComponentLink4Description: URL Link1; DatasheetVersion: Rev. E; PartNumber: ADP151ACBZ-1.1-R7; ComponentLink3Description: Package Specification; ComponentLink2Description: Datasheet; Mounting Technology: Surface Mount; ComponentLink1URL: http://www.analog.com/en/index.html; Packing: Reel; PackageVersion: 011409-A, 01/2009; ComponentLink2URL: http://www.analog.com/static/imported-files/data_sheets/ADP151.pdf

## Sheet Misc.SchDoc
size 420 x 297 mm; SheetNumber: 3; SheetTotal: 4
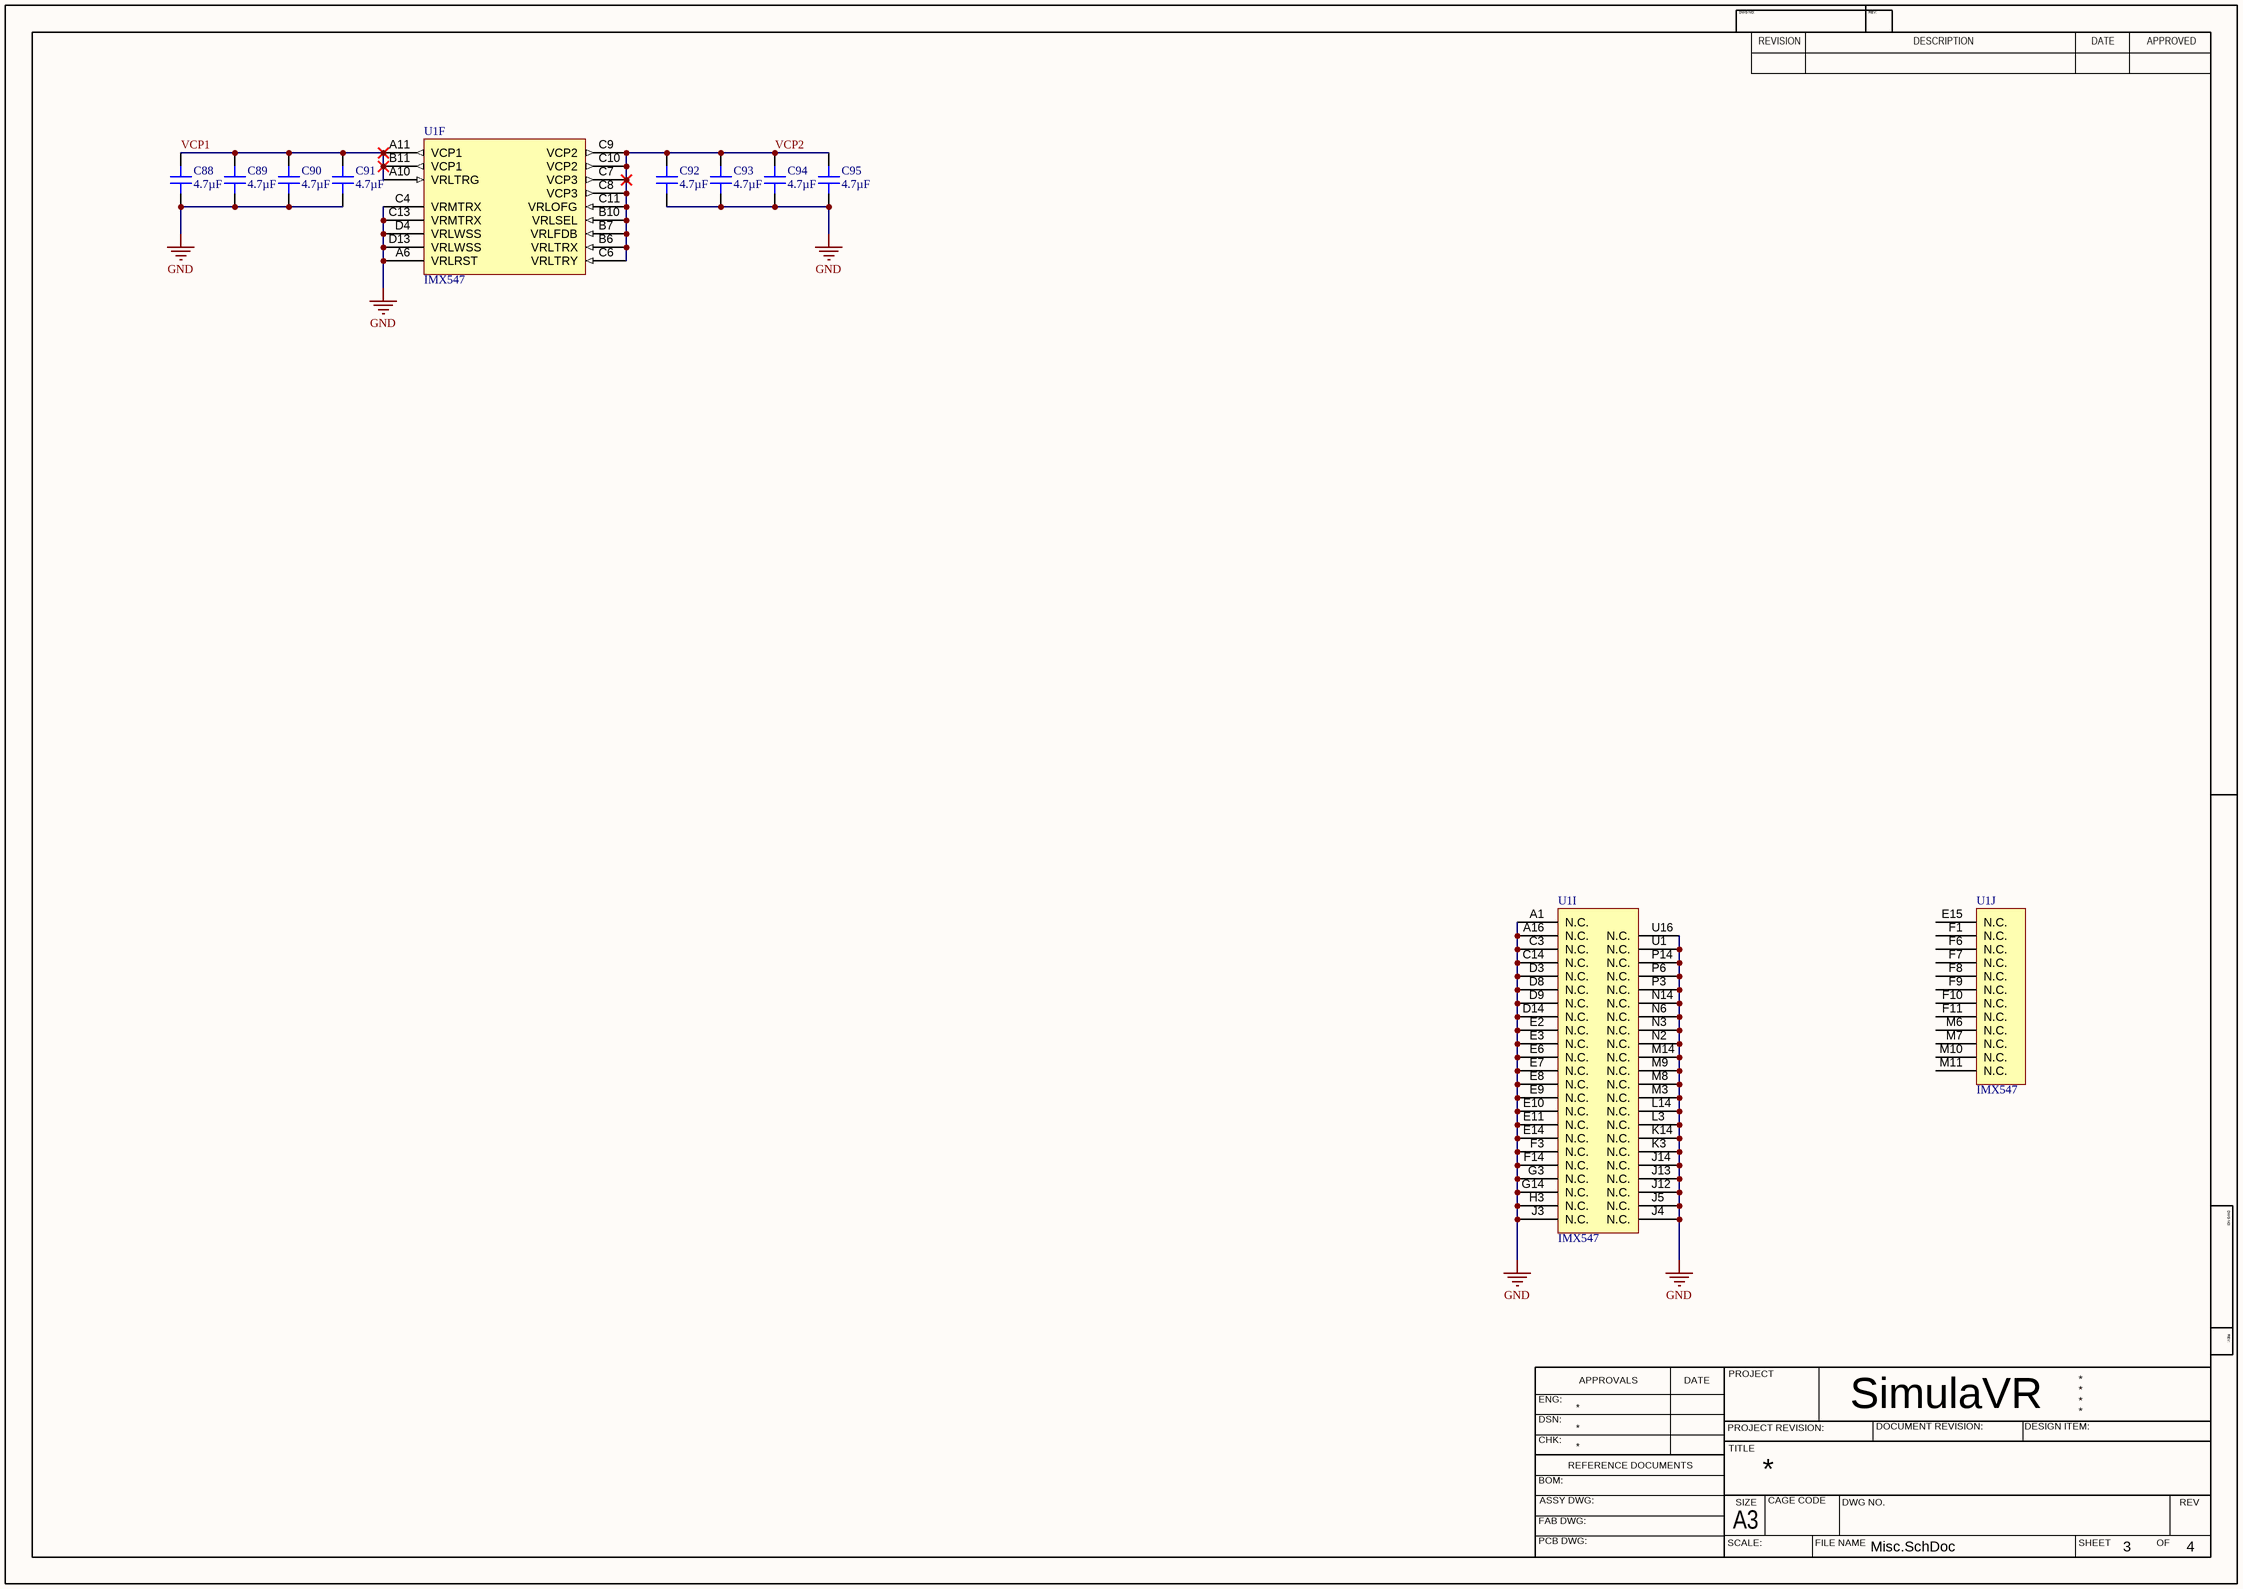
[diagram p2: Misc.SchDoc]

### Parts
C88  4.7µF  [FP-GRM155-0_15-MFG]
C89  4.7µF  [FP-GRM155-0_15-MFG]
C90  4.7µF  [FP-GRM155-0_15-MFG]
C91  4.7µF  [FP-GRM155-0_15-MFG]
C92  4.7µF  [FP-GRM155-0_15-MFG]
C93  4.7µF  [FP-GRM155-0_15-MFG]
C94  4.7µF  [FP-GRM155-0_15-MFG]
C95  4.7µF  [FP-GRM155-0_15-MFG]
U1  IMX547  [LGA230C100P16X17_1680X2000X260]  (parts F,I,J of 11)

### Nets
GND: C88.1 C89.1 C90.1 C91.1 C92.1 C93.1 C94.1 C95.1 U1.A1(N.C.) U1.A6(VRLRST) U1.A16(N.C.) U1.C3(N.C.) U1.C4(VRMTRX) U1.C13(VRMTRX) U1.C14(N.C.) U1.D3(N.C.) U1.D4(VRLWSS) U1.D8(N.C.) U1.D9(N.C.) U1.D13(VRLWSS) U1.D14(N.C.) U1.E2(N.C.) U1.E3(N.C.) U1.E6(N.C.) U1.E7(N.C.) U1.E8(N.C.) U1.E9(N.C.) U1.E10(N.C.) U1.E11(N.C.) U1.E14(N.C.) U1.F3(N.C.) U1.F14(N.C.) U1.G3(N.C.) U1.G14(N.C.) U1.H3(N.C.) U1.J3(N.C.) U1.J4(N.C.) U1.J5(N.C.) U1.J12(N.C.) U1.J13(N.C.) U1.J14(N.C.) U1.K3(N.C.) U1.K14(N.C.) U1.L3(N.C.) U1.L14(N.C.) U1.M3(N.C.) U1.M8(N.C.) U1.M9(N.C.) U1.M14(N.C.) U1.N2(N.C.) U1.N3(N.C.) U1.N6(N.C.) U1.N14(N.C.) U1.P3(N.C.) U1.P6(N.C.) U1.P14(N.C.) U1.U1(N.C.) U1.U16(N.C.)
VCP1: C88.2 C89.2 C90.2 C91.2 U1.A10(VRLTRG) U1.A11(VCP1) U1.B11(VCP1)
VCP2: C92.2 C93.2 C94.2 C95.2 U1.B6(VRLTRX) U1.B7(VRLFDB) U1.B10(VRLSEL) U1.C6(VRLTRY) U1.C7(VCP3) U1.C8(VCP3) U1.C9(VCP2) U1.C10(VCP2) U1.C11(VRLOFG)

Not connected (* = marked no-connect by the designer): U1 E15(N.C.) F1(N.C.) F6(N.C.) F7(N.C.) F8(N.C.) F9(N.C.) F10(N.C.) F11(N.C.) M6(N.C.) M7(N.C.) M10(N.C.) M11(N.C.)

### Notes on the sheet
- DWG NO:
- REVISION
- REV:
- DESCRIPTION
- DATE
- APPROVED
- ENG:
- APPROVALS
- PROJECT
- DSN:
- CHK:
- REFERENCE DOCUMENTS
- PROJECT REVISION:
- TITLE
- SimulaVR
- DOCUMENT REVISION:
- DESIGN ITEM:
- BOM:
- FAB DWG:
- PCB DWG:
- ASSY DWG:
- SCALE:
- A3
- SIZE
- CAGE CODE
- FILE NAME
- DWG NO.
- SHEET
- OF
- REV

### Library data of the parts
C88-C95 = GRM155R61A475MEAAD: as C101 on sheet AnalogSupplies; Part Number: GRM155R61A475MEAAD; Value: 4.7µF; Applications: General Purpose; Capacitance: 4.7µF; ComponentLink1Description: Datasheet; ComponentLink1URL: https://search.murata.co.jp/Ceramy/image/img/A01X/G101/ENG/GRM155R61A475MEAA-01.pdf; ComponentLink2Description: DigiKey Link; ComponentLink2URL: https://www.digikey.com/en/products/detail/murata-electronics/GRM155R61A475MEAAD/6234735; Device Package: 0402 (1005 Metric); LastUpdated: 2/8/2022 12:26:50 PM; Lifecycle Status: Active; Minimum Order: 1; Mounting Type: Surface Mount, MLCC; Operating Temperature: -55°C ~ 85°C; Package / Case: 0402 (1005 Metric); Packaging: TapeAndReel; PartId: 6746; Part Status: Active; Price: 0.03; Series: GRM; Size / Dimension: 0.039" L x 0.020" W (1.00mm x 0.50mm); Supplier 1: DigiKey; Supplier Part Number 1: 490-14306-1-ND; Temperature Coefficient: X5R; Thickness (Max): 0.026" (0.65mm); Voltage - Rated: 10V
U1 = CMP-001-0000-4: Sony IMX547 sensor

## Sheet DigitalIO.SchDoc
size 420 x 297 mm; SheetNumber: 4; SheetTotal: 4
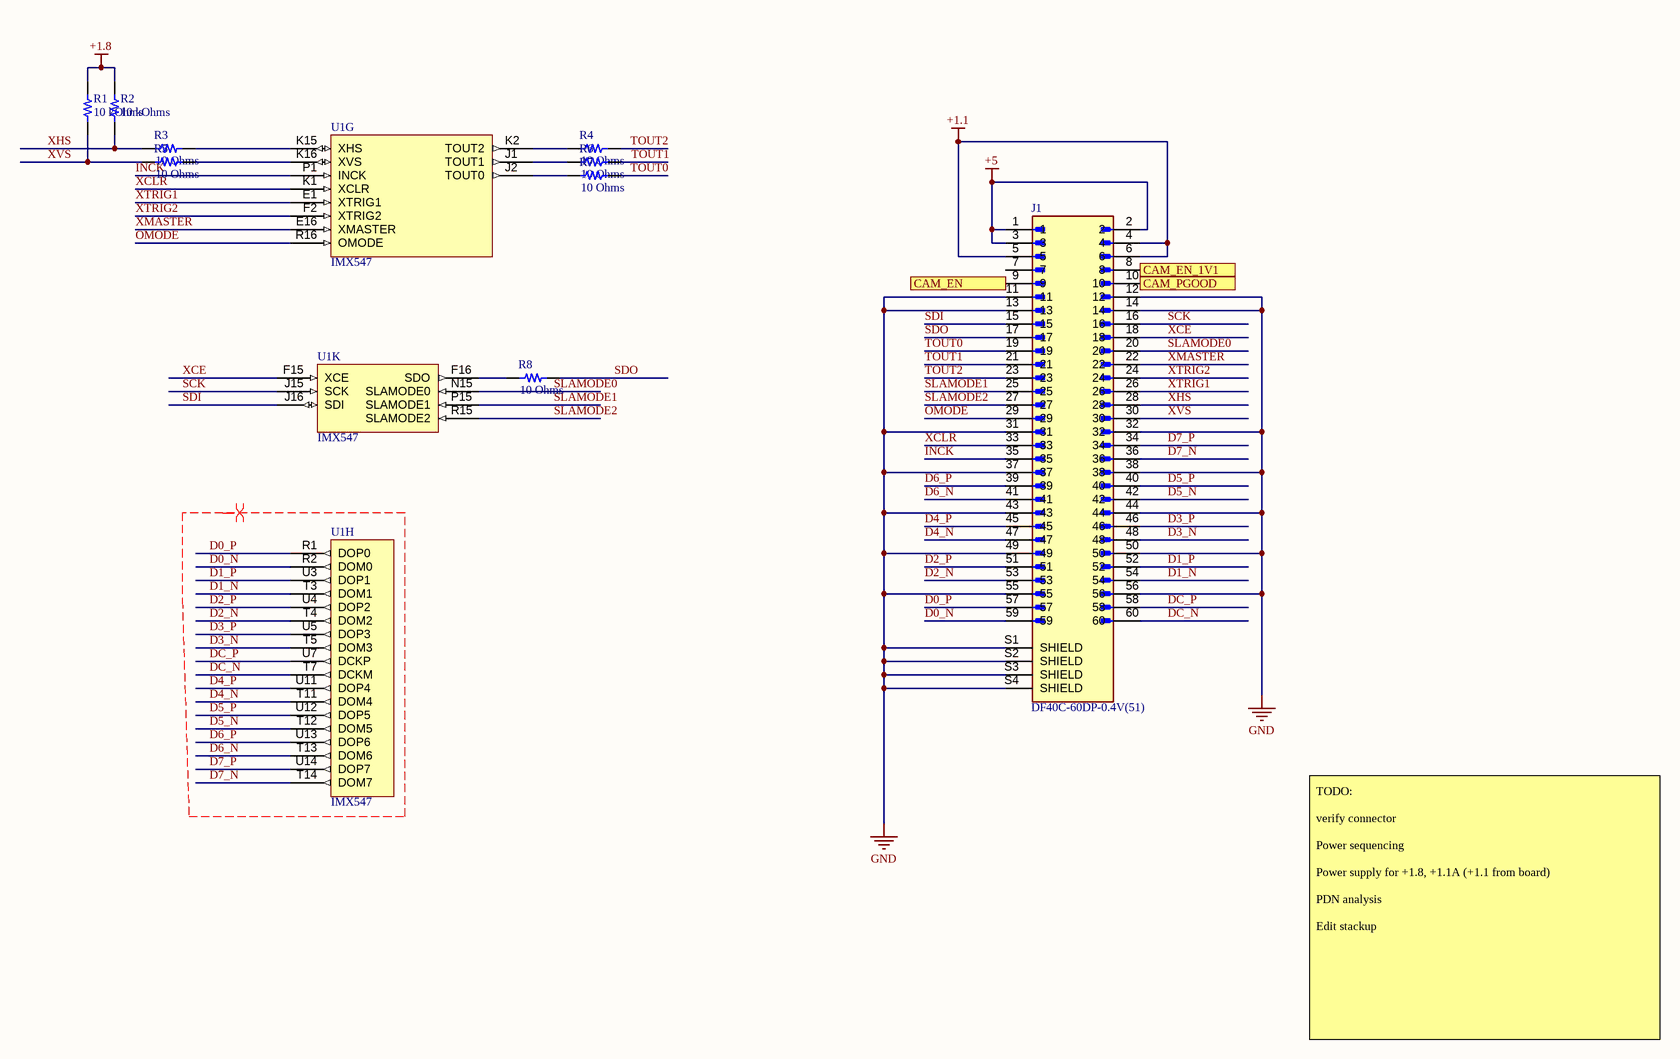
[diagram p3: DigitalIO.SchDoc]

### Parts
J1  DF40C-60DP-0.4V(51)  [HIROSE_DF40C-60DP-0.4V(51)]
R1  10 kOhms  [RES 0201_0603]
R2  10 kOhms  [RES 0201_0603]
R3  10 Ohms  [RES 0201_0603]
R4  10 Ohms  [RES 0201_0603]
R5  10 Ohms  [RES 0201_0603]
R6  10 Ohms  [RES 0201_0603]
R7  10 Ohms  [RES 0201_0603]
R8  10 Ohms  [RES 0201_0603]
U1  IMX547  [LGA230C100P16X17_1680X2000X260]  (parts G,H,K of 11)

### Ports
CAM_EN (out), CAM_EN_1V1 (in), CAM_PGOOD (in)

### Nets
+1.1: J1.4 J1.5 J1.6
+1.8: R1.2 R2.2
+5: J1.1 J1.2 J1.3
GND: J1.11 J1.12 J1.13 J1.14 J1.31 J1.32 J1.37 J1.38 J1.43 J1.44 J1.49 J1.50 J1.55 J1.56 J1.S1(SHIELD) J1.S2(SHIELD) J1.S3(SHIELD) J1.S4(SHIELD)
D0_N: J1.59 U1.R2(DOM0)
D0_P: J1.57 U1.R1(DOP0)
D1_N: J1.54 U1.T3(DOM1)
D1_P: J1.52 U1.U3(DOP1)
D2_N: J1.53 U1.T4(DOM2)
D2_P: J1.51 U1.U4(DOP2)
D3_N: J1.48 U1.T5(DOM3)
D3_P: J1.46 U1.U5(DOP3)
D4_N: J1.47 U1.T11(DOM4)
D4_P: J1.45 U1.U11(DOP4)
D5_N: J1.42 U1.T12(DOM5)
D5_P: J1.40 U1.U12(DOP5)
D6_N: J1.41 U1.T13(DOM6)
D6_P: J1.39 U1.U13(DOP6)
D7_N: J1.36 U1.T14(DOM7)
D7_P: J1.34 U1.U14(DOP7)
DC_N: J1.60 U1.T7(DCKM)
DC_P: J1.58 U1.U7(DCKP)
INCK: J1.35 U1.P1(INCK)
OMODE: J1.29 U1.R16(OMODE)
SCK: J1.16 U1.J15(SCK)
SDI: J1.15 U1.J16(SDI)
SDO: J1.17 R8.2
SLAMODE0: J1.20 U1.N15(SLAMODE0)
SLAMODE1: J1.25 U1.P15(SLAMODE1)
SLAMODE2: J1.27 U1.R15(SLAMODE2)
TOUT0: J1.19 R7.2
TOUT1: J1.21 R6.2
TOUT2: J1.23 R4.2
XCE: J1.18 U1.F15(XCE)
XCLR: J1.33 U1.K1(XCLR)
XHS: J1.28 R2.1 R3.1
XMASTER: J1.22 U1.E16(XMASTER)
XTRIG1: J1.26 U1.E1(XTRIG1)
XTRIG2: J1.24 U1.F2(XTRIG2)
XVS: J1.30 R1.1 R5.1
NetJ1_8: J1.8 ; port CAM_EN_1V1
NetJ1_9: J1.9 ; port CAM_EN
NetJ1_10: J1.10 ; port CAM_PGOOD
NetR3_2: R3.2 U1.K15(XHS)
NetR4_1: R4.1 U1.K2(TOUT2)
NetR5_2: R5.2 U1.K16(XVS)
NetR6_1: R6.1 U1.J1(TOUT1)
NetR7_1: R7.1 U1.J2(TOUT0)
NetR8_1: R8.1 U1.F16(SDO)

Not connected (* = marked no-connect by the designer): J1 7

### Layout directives
differential pair; differential pair class SLVSEC; net class SLVSEC: D0_N, D0_P, D1_N, D1_P, D2_N, D2_P, D3_N, D3_P, D4_N, D4_P, D5_N, D5_P, D6_N, D6_P, D7_N, D7_P, DC_N, DC_P

### Notes on the sheet
- TODO:
  verify connector
  Power sequencing
  Power supply for +1.8, +1.1A (+1.1 from board)
  PDN analysis
  Edit stackup
- DWG NO:
- REVISION
- REV:
- DESCRIPTION
- DATE
- APPROVED
- ENG:
- APPROVALS
- PROJECT
- DSN:
- CHK:
- REFERENCE DOCUMENTS
- PROJECT REVISION:
- TITLE
- SimulaVR
- DOCUMENT REVISION:
- DESIGN ITEM:
- BOM:
- FAB DWG:
- PCB DWG:
- ASSY DWG:
- SCALE:
- A3
- SIZE
- CAGE CODE
- FILE NAME
- DWG NO.
- SHEET
- OF
- REV

### Library data of the parts
J1 = DF40C-60DP-0.4V(51): 60 Position Connector Plug, Outer Shroud Contacts Surface Mount Gold; MF: {'manufacturer': u'Hirose Electric'}; Price: None; Value: *; MP: DF40C-60DP-0.4V(51); Availability: Unavailable; Package: None
R1 R2 = RMCF0201JG10K0: RES 10K OHM 5% 1/20W 0201; Manufacturer: Stackpole Electronics Inc; Power (Watts): 0.05W, 1/20W; Temperature Coefficient: ±200ppm/°C; Part Number: RMCF0201JG10K0; Value: 10 kOhms; ComponentLink1Description: Datasheet; ComponentLink1URL: https://www.seielect.com/catalog/sei-rmcf_rmcp.pdf; ComponentLink2Description: DigiKey Link; ComponentLink2URL: https://www.digikey.com/en/products/detail/stackpole-electronics-inc/RMCF0201JG10K0/6053790; Composition: Thick Film; Device Package: 0201 (0603 Metric); Height - Seated (Max): 0.010" (0.26mm); LastUpdated: 19.09.2022 13:09:10; Lifecycle Status: Active; Minimum Order: 1; Number of Terminations: 2; Operating Temperature: -55°C ~ 155°C; Package / Case: 0201 (0603 Metric); Packaging: CutTape; PartId: 1335; Part Status: Active; Price: 0.01; Ratings: AEC-Q200; Resistance: 10 kOhms; Series: RMCF; Size / Dimension: 0.024" L x 0.012" W (0.60mm x 0.30mm); Supplier 1: DigiKey; Supplier Part Number 1: RMCF0201JG10K0CT-ND; Supplier Device Package: 0201; Tolerance: ±5%
R3-R8 = CRG0201F10R: RES SMD 10 OHM 1% 1/20W 0201; Manufacturer: TE Connectivity Passive Product; Power (Watts): 0.05W, 1/20W; Temperature Coefficient: ±400ppm/°C; Part Number: CRG0201F10R; Value: 10 Ohms; ComponentLink1Description: Datasheet; ComponentLink1URL: https://www.te.com/commerce/DocumentDelivery/DDEController?Action=srchrtrv&DocNm=1773204&DocType=DS&DocLang=English; ComponentLink2Description: DigiKey Link; ComponentLink2URL: https://www.digikey.com/en/products/detail/te-connectivity-passive-product/CRG0201F10R/4489648; Composition: Thick Film; Device Package: 0201 (0603 Metric); Height - Seated (Max): 0.010" (0.26mm); LastUpdated: 8/11/2022 9:03:27 AM; Lifecycle Status: Active; Minimum Order: 1; Number of Terminations: 2; Operating Temperature: -55°C ~ 155°C; Package / Case: 0201 (0603 Metric); Packaging: TapeAndReel; PartId: 3; Part Status: Active; Price: 0.03; Resistance: 10 Ohms; Series: CRG, Neohm; Size / Dimension: 0.024" L x 0.012" W (0.60mm x 0.30mm); Supplier 1: DigiKey; Supplier Part Number 1: A129573CT-ND; Supplier Device Package: 0201; Tolerance: ±1%
U1 = CMP-001-0000-4: Sony IMX547 sensor

## Nets that join several sheets
+1.1: DigitalSupplies (70 pins), DigitalIO (J1.4 J1.5 J1.6)
+1.8: DigitalSupplies (6 pins), DigitalIO (R1.2 R2.2)
+5: DigitalSupplies (C112.2 C114.2 U4.A1 U5.A1), DigitalIO (J1.1 J1.2 J1.3)
GND: AnalogSupplies (74 pins), DigitalSupplies (101 pins), Misc (58 pins), DigitalIO (18 pins)